# Altium project ECU V1.0 B.PrjPcb (part 15 of 15)
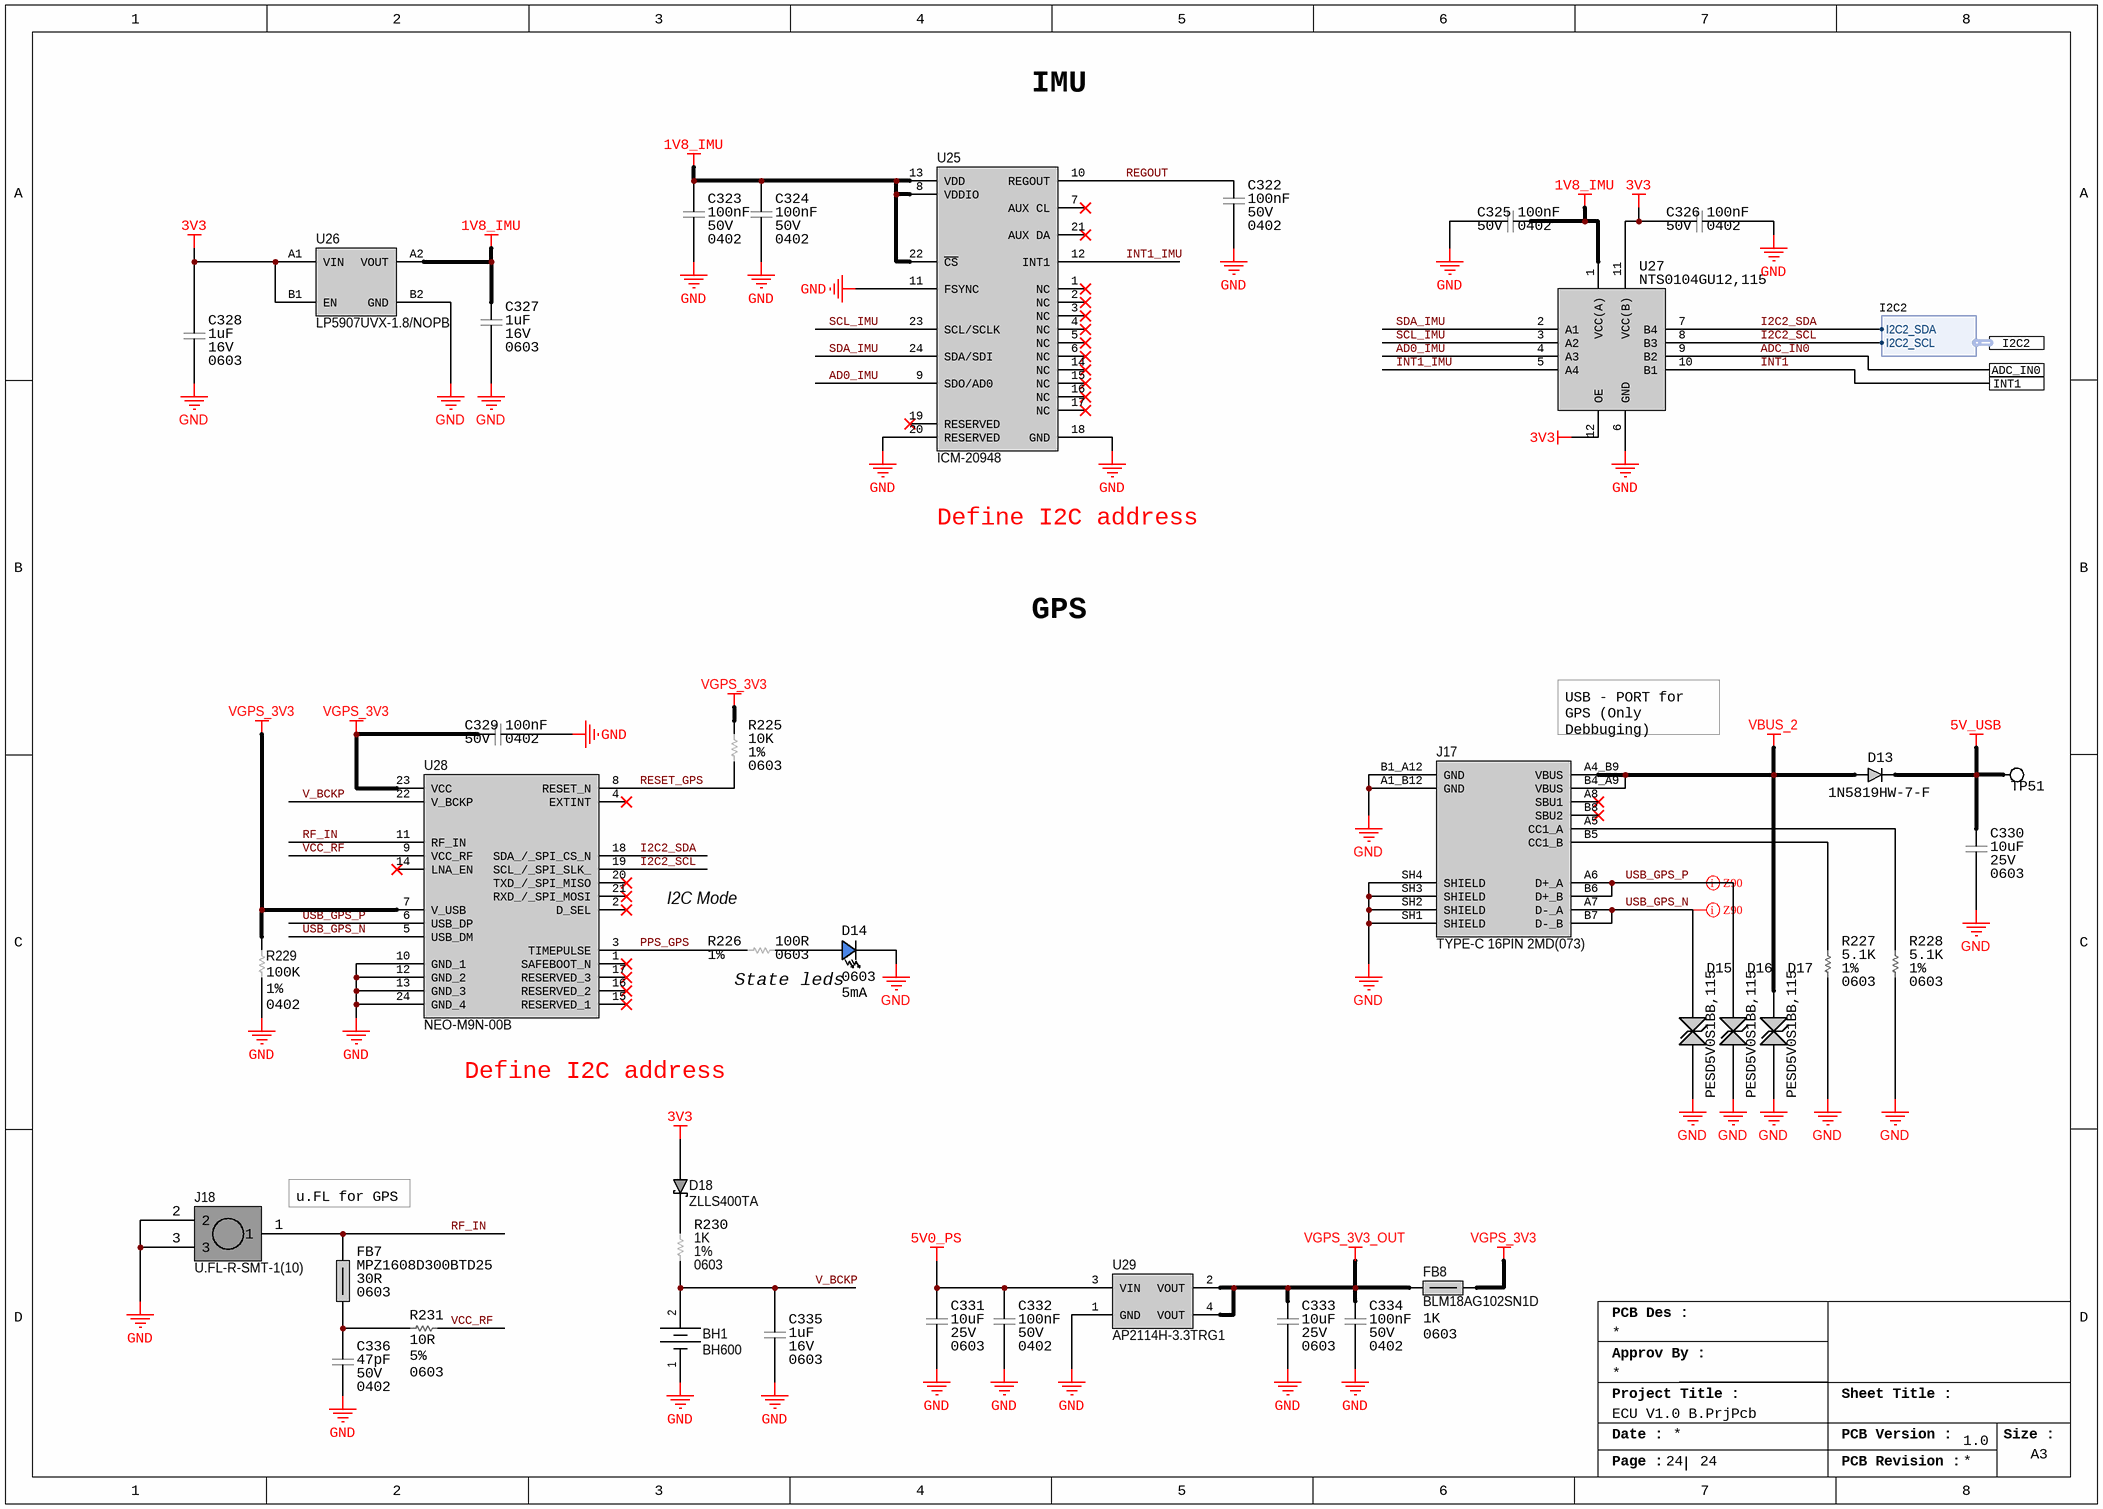
[diagram p116: 23_IMU_GPS.SchDoc]

## Nets that join several sheets
1V8: 03_iMX 8X_PMIC (R237.2), 20_V2X_MODEM (C303.2 R177.1 U18.1), 17_CAN_BUS (C250.2 R96.2 U8.1), 18_ETH (R123.2), 06_iMX 8X_CAN (C85.2 C86.2 U1.AG27), 07_iMX 8X_LPDDR4 (L6.1), 05_iMX 8X_PCIE (5 pins), 13_iMX 8X_SYSTEM (J4.3 J5.3)
3V3: 20_V2X_MODEM (13 pins), 17_CAN_BUS (5 pins), 18_ETH (7 pins), 02_PWR IN (R233.2), 09_iMX 8X_SD CARD & V2X (7 pins), 05_iMX 8X_PCIE (C83.2 C84.2 U1.L9), 23_IMU_GPS (7 pins)
3V3_PS: 03_iMX 8X_PMIC (R232.1), 02_PWR IN (22 pins)
5V0_PS: 03_iMX 8X_PMIC (C45.2 U2.19), 20_V2X_MODEM (R179.1 R180.2), 02_PWR IN (22 pins), 22_Nvidia_CAN (FB6.1), 23_IMU_GPS (C331.2 C332.2 U29.3)
12V0: 20_V2X_MODEM (R178.2), 04_iMX 8X_PWR (R1.1 R2.1), 02_PWR IN (11 pins)
GND: 03_iMX 8X_PMIC (44 pins), 20_V2X_MODEM (44 pins), 04_iMX 8X_PWR (149 pins), 17_CAN_BUS (33 pins), 18_ETH (41 pins), 16_LPDDR (97 pins), 02_PWR IN (62 pins), 06_iMX 8X_CAN (C85.1 C86.1), 07_iMX 8X_LPDDR4 (18 pins), 09_iMX 8X_SD CARD & V2X (7 pins), 05_iMX 8X_PCIE (10 pins), 13_iMX 8X_SYSTEM (11 pins), 22_Nvidia_CAN (13 pins), 23_IMU_GPS (41 pins)
PMIC_VDD_DDRIO: 03_iMX 8X_PMIC (7 pins), 02_PWR IN (R236.2)
VDD_DDR_VDDQ: 16_LPDDR (R90.2 R91.2), 07_iMX 8X_LPDDR4 (24 pins)
3V3_5V0_PS_EN: 04_iMX 8X_PWR (D1.1 Q1.D), 02_PWR IN (U3.22)
CAN1_CANH: 17_CAN_BUS (5 pins), 22_Nvidia_CAN (R224.2)
CAN1_CANL: 17_CAN_BUS (5 pins), 22_Nvidia_CAN (R218.2)
DDR_CA0_A: 16_LPDDR (U6.H2), 07_iMX 8X_LPDDR4 (U1.W1)
DDR_CA1_A: 16_LPDDR (U6.J2), 07_iMX 8X_LPDDR4 (U1.U1)
DDR_CA2_A: 16_LPDDR (U6.H9), 07_iMX 8X_LPDDR4 (U1.N1)
DDR_CA3_A: 16_LPDDR (U6.H10), 07_iMX 8X_LPDDR4 (U1.N3)
DDR_CA4_A: 16_LPDDR (U6.H11), 07_iMX 8X_LPDDR4 (U1.J1)
DDR_CA5_A: 16_LPDDR (U6.J11), 07_iMX 8X_LPDDR4 (U1.J3)
DDR_CKE0_A: 16_LPDDR (U6.J4), 07_iMX 8X_LPDDR4 (R35.2 U1.T2)
DDR_CLKA_N: 16_LPDDR (U6.J9), 07_iMX 8X_LPDDR4 (U1.K2)
DDR_CLKA_P: 16_LPDDR (U6.J8), 07_iMX 8X_LPDDR4 (U1.L1)
DDR_CS0_A: 16_LPDDR (U6.H4), 07_iMX 8X_LPDDR4 (U1.R1)
DDR_DMI1: 16_LPDDR (U6.C10), 07_iMX 8X_LPDDR4 (U1.AE1)
DDR_DMIO: 16_LPDDR (U6.C3), 07_iMX 8X_LPDDR4 (U1.AN3)
DDR_DQ0: 16_LPDDR (U6.B2), 07_iMX 8X_LPDDR4 (U1.AJ1)
DDR_DQ1: 16_LPDDR (U6.C2), 07_iMX 8X_LPDDR4 (U1.AK2)
DDR_DQ2: 16_LPDDR (U6.E2), 07_iMX 8X_LPDDR4 (U1.AL1)
DDR_DQ3: 16_LPDDR (U6.F2), 07_iMX 8X_LPDDR4 (U1.AM2)
DDR_DQ4: 16_LPDDR (U6.F4), 07_iMX 8X_LPDDR4 (U1.AR3)
DDR_DQ5: 16_LPDDR (U6.C4 U6.E4), 07_iMX 8X_LPDDR4 (U1.AP4 U1.AR5)
DDR_DQ7: 16_LPDDR (U6.B4), 07_iMX 8X_LPDDR4 (U1.AP6)
DDR_DQ8: 16_LPDDR (U6.B11), 07_iMX 8X_LPDDR4 (U1.AJ3)
DDR_DQ9: 16_LPDDR (U6.C11), 07_iMX 8X_LPDDR4 (U1.AH2)
DDR_DQ10: 16_LPDDR (U6.E11), 07_iMX 8X_LPDDR4 (U1.AG1)
DDR_DQ11: 16_LPDDR (U6.F11), 07_iMX 8X_LPDDR4 (U1.AF2)
DDR_DQ12: 16_LPDDR (U6.F9), 07_iMX 8X_LPDDR4 (U1.AC1)
DDR_DQ13: 16_LPDDR (U6.E9), 07_iMX 8X_LPDDR4 (U1.AB2)
DDR_DQ14: 16_LPDDR (U6.C9), 07_iMX 8X_LPDDR4 (U1.AA1)
DDR_DQ15: 16_LPDDR (U6.B9), 07_iMX 8X_LPDDR4 (U1.AA3)
DDR_DQS0_N: 16_LPDDR (U6.E3), 07_iMX 8X_LPDDR4 (U1.AP2)
DDR_DQS0_P: 16_LPDDR (U6.D3), 07_iMX 8X_LPDDR4 (U1.AN1)
DDR_DQS1_N: 16_LPDDR (U6.E10), 07_iMX 8X_LPDDR4 (U1.AD2)
DDR_DQS1_P: 16_LPDDR (U6.D10), 07_iMX 8X_LPDDR4 (U1.AE3)
DRAM_RST: 16_LPDDR (U6.T11), 07_iMX 8X_LPDDR4 (R36.2 U1.H2)
ENET0_MDC: 20_V2X_MODEM (J14.50), 09_iMX 8X_SD CARD & V2X (U1.E33)
ENET0_MDIO: 20_V2X_MODEM (J14.48), 09_iMX 8X_SD CARD & V2X (U1.E35)
ENET0_REFCLK: 20_V2X_MODEM (J14.04 U17.4), 09_iMX 8X_SD CARD & V2X (R46.2)
ENET0_RGMII_RX_CTL: 20_V2X_MODEM (J14.28), 09_iMX 8X_SD CARD & V2X (U1.C33)
ENET0_RGMII_RXC: 20_V2X_MODEM (J14.32), 09_iMX 8X_SD CARD & V2X (U1.B34)
ENET0_RGMII_RXD0: 20_V2X_MODEM (J14.36), 09_iMX 8X_SD CARD & V2X (U1.B32)
ENET0_RGMII_RXD1: 20_V2X_MODEM (J14.38), 09_iMX 8X_SD CARD & V2X (U1.A33)
ENET0_RGMII_RXD2: 20_V2X_MODEM (J14.42), 09_iMX 8X_SD CARD & V2X (U1.C31)
ENET0_RGMII_RXD3: 20_V2X_MODEM (J14.44), 09_iMX 8X_SD CARD & V2X (U1.A31)
ENET0_RGMII_TX_CTL: 20_V2X_MODEM (J14.24), 09_iMX 8X_SD CARD & V2X (U1.C35)
ENET0_RGMII_TXC: 20_V2X_MODEM (J14.20), 09_iMX 8X_SD CARD & V2X (U1.G27)
ENET0_RGMII_TXD0: 20_V2X_MODEM (J14.16), 09_iMX 8X_SD CARD & V2X (U1.J29)
ENET0_RGMII_TXD1: 20_V2X_MODEM (J14.14), 09_iMX 8X_SD CARD & V2X (U1.G29)
ENET0_RGMII_TXD2: 20_V2X_MODEM (J14.10), 09_iMX 8X_SD CARD & V2X (U1.L29)
ENET0_RGMII_TXD3: 20_V2X_MODEM (J14.08), 09_iMX 8X_SD CARD & V2X (U1.N29)
FLEXCAN2_RX: 17_CAN_BUS (U8.6), 06_iMX 8X_CAN (U1.AL35)
FLEXCAN2_TX: 17_CAN_BUS (U8.4), 06_iMX 8X_CAN (U1.AL33)
I2C3_SCL: 20_V2X_MODEM (J14.54), 02_PWR IN (R68.1 U3.2)
I2C3_SDA: 20_V2X_MODEM (J14.52), 02_PWR IN (R69.1 U3.3)
PMIC_I2C_SCL: 03_iMX 8X_PMIC (U2.11), 13_iMX 8X_SYSTEM (R59.1 U1.AP30)
PMIC_I2C_SDA: 03_iMX 8X_PMIC (U2.10), 13_iMX 8X_SYSTEM (R60.1 U1.AP28)
PMIC_INT_B: 03_iMX 8X_PMIC (R18.1), 13_iMX 8X_SYSTEM (U1.AN27)
PMIC_ON_REQ: 03_iMX 8X_PMIC (R17.1), 13_iMX 8X_SYSTEM (R57.1 U1.AR19)
PMIC_STBY: 03_iMX 8X_PMIC (R15.1), 13_iMX 8X_SYSTEM (U1.AN25)
PMIC_WDOG_IN: 03_iMX 8X_PMIC (R19.1), 13_iMX 8X_SYSTEM (U1.AG29)
SPI2_CS0: 20_V2X_MODEM (U19.11), 09_iMX 8X_SD CARD & V2X (U1.C29)
SPI2_SCK: 20_V2X_MODEM (U19.10), 09_iMX 8X_SD CARD & V2X (U1.A29)
SPI2_SD0: 20_V2X_MODEM (U19.13), 09_iMX 8X_SD CARD & V2X (U1.B28)
SPI2_SDI: 20_V2X_MODEM (U19.12), 09_iMX 8X_SD CARD & V2X (U1.B30)
UART2_RX: 17_CAN_BUS (U8.7), 06_iMX 8X_CAN (U1.AP34)
UART2_TX: 17_CAN_BUS (U8.5), 06_iMX 8X_CAN (U1.AN33)

## Assembly variants
Base Variant: not fitted D9 D10 D11 D12 D13 D14 D15 D16 J16 J16 R44 R44 R89 R93 R98 R102 R107 R111 R115 R119